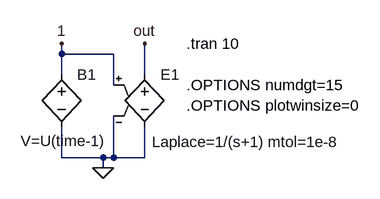
[diagram p0: schematic Fig_2-74_E-Laplace_Test-Unit1.asc]
Fig_2-74_E-Laplace_Test-Unit1.asc, the LTspice schematic file:
Version 4
SHEET 1 880 680
WIRE 32 112 32 96
WIRE 112 112 32 112
WIRE 32 144 32 112
WIRE 160 144 160 96
WIRE 112 160 112 112
WIRE 32 272 32 224
WIRE 96 272 32 272
WIRE 112 272 112 208
WIRE 112 272 96 272
WIRE 160 272 160 224
WIRE 160 272 112 272
WIRE 96 288 96 272
FLAG 96 288 0
FLAG 32 96 1
FLAG 160 96 out
SYMBOL bv 32 128 R0
WINDOW 3 -63 118 Left 2
SYMATTR Value V=U(time-1)
SYMATTR InstName B1
SYMBOL e 160 128 R0
WINDOW 3 11 120 Left 2
SYMATTR Value Laplace=1/(s+1) mtol=1e-8
SYMATTR InstName E1
TEXT 224 96 Left 2 !.tran 10
TEXT 224 160 Left 2 !.OPTIONS numdgt=15\n.OPTIONS plotwinsize=0

The netlist it stands for:
* Fig_2-74_E-Laplace_Test-Unit1.asc
B1 1 0 V=U(time-1)
E1 out 0 1 0 Laplace=1/(s+1) mtol=1e-8
.tran 10
.OPTIONS numdgt=15
.OPTIONS plotwinsize=0
.backanno
.end